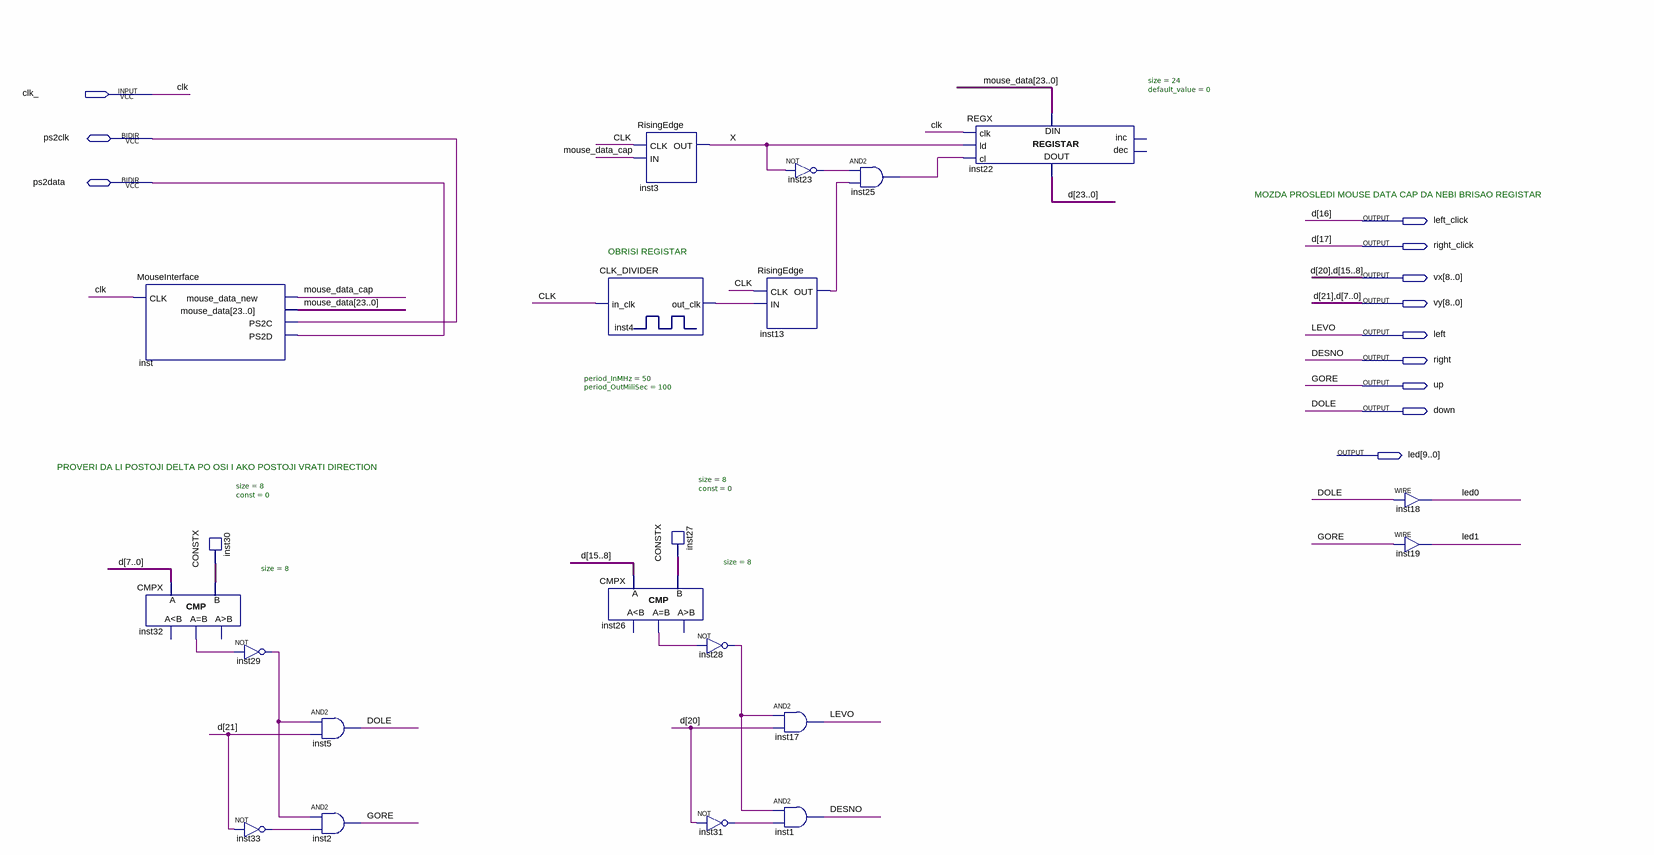
[diagram p0: schematic sheet]
// Quartus schematic mouse.bdf as structural Verilog: 21 symbols, 12 pins
module mouse (
  input  clk_,
  inout  ps2clk,
  inout  ps2data,
  output left_click,
  output right_click,
  output [8:0] vx,
  output [8:0] vy,
  output left,
  output right,
  output up,
  output down,
  output [9:0] led
);

  wire inst4_out_clk, inst13_out, inst23_out, inst25_out, inst26_eq, inst28_out, inst29_out, inst31_out,
       inst32_eq, inst33_out, mouse_data_cap, X;
  wire [7:0] inst27_data, inst30_data;
  wire [23:0] mouse_data;
  wire [23:18] d;

  MouseInterface inst (
    .CLK(clk_), .mouse_data_new(mouse_data_cap), .mouse_data(mouse_data), .PS2C(ps2clk), .PS2D(ps2data));
  CMPX #(.size(8)) inst32 (.A(vy[7:0]), .B(inst30_data), .eq(inst32_eq));  // open: ls, gr
  CONSTX #(.size(8), .\const (0)) inst30 (.data(inst30_data));
  not inst29 (inst29_out, inst32_eq);
  not inst33 (inst33_out, vy[8]);
  and inst5 (down, inst29_out, vy[8]);
  and inst2 (up, inst29_out, inst33_out);
  RisingEdge inst3 (.CLK(clk_), .IN(mouse_data_cap), .OUT(X));
  CLK_DIVIDER #(.period_InMHz(50), .period_OutMiliSec(100)) inst4 (.in_clk(clk_), .out_clk(inst4_out_clk));
  CMPX #(.size(8)) inst26 (.A(vx[7:0]), .B(inst27_data), .eq(inst26_eq));  // open: ls, gr
  CONSTX #(.size(8), .\const (0)) inst27 (.data(inst27_data));
  not inst28 (inst28_out, inst26_eq);
  not inst31 (inst31_out, vx[8]);
  not inst23 (inst23_out, X);
  RisingEdge inst13 (.CLK(clk_), .IN(inst4_out_clk), .OUT(inst13_out));
  and inst17 (left, inst28_out, vx[8]);
  and inst1 (right, inst28_out, inst31_out);
  and inst25 (inst25_out, inst23_out, inst13_out);
  REGX #(.size(24), .default_value(0)) inst22 (
    .clk(clk_), .ld(X), .cl(inst25_out), .data_in(mouse_data),
    .data_out({d[23:22], vy[8], vx[8], d[19:18], right_click, left_click, vx[7:0], vy[7:0]}));  // open: inc, dec
  assign led[0] = down;  // WIRE inst18
  assign led[1] = up;  // WIRE inst19

  // Other names for the same wires on the sheet: clk = clk_;
  //   d (some bits) = {vy[8], vx[8], right_click, left_click, vx[7:0], vy[7:0]}; DESNO = right; DOLE = down;
  //   GORE = up; LEVO = left

  // Notes on the sheet:
  //   MOZDA PROSLEDI MOUSE DATA CAP DA NEBI BRISAO REGISTAR
  //   OBRISI REGISTAR
  //   PROVERI DA LI POSTOJI DELTA PO OSI I AKO POSTOJI VRATI DIRECTION
endmodule
